# Altium schematic sheet obc-v2_RTC-WDOG.SchDoc
size 420 x 297 mm; SheetNumber: 7; SheetTotal: 23
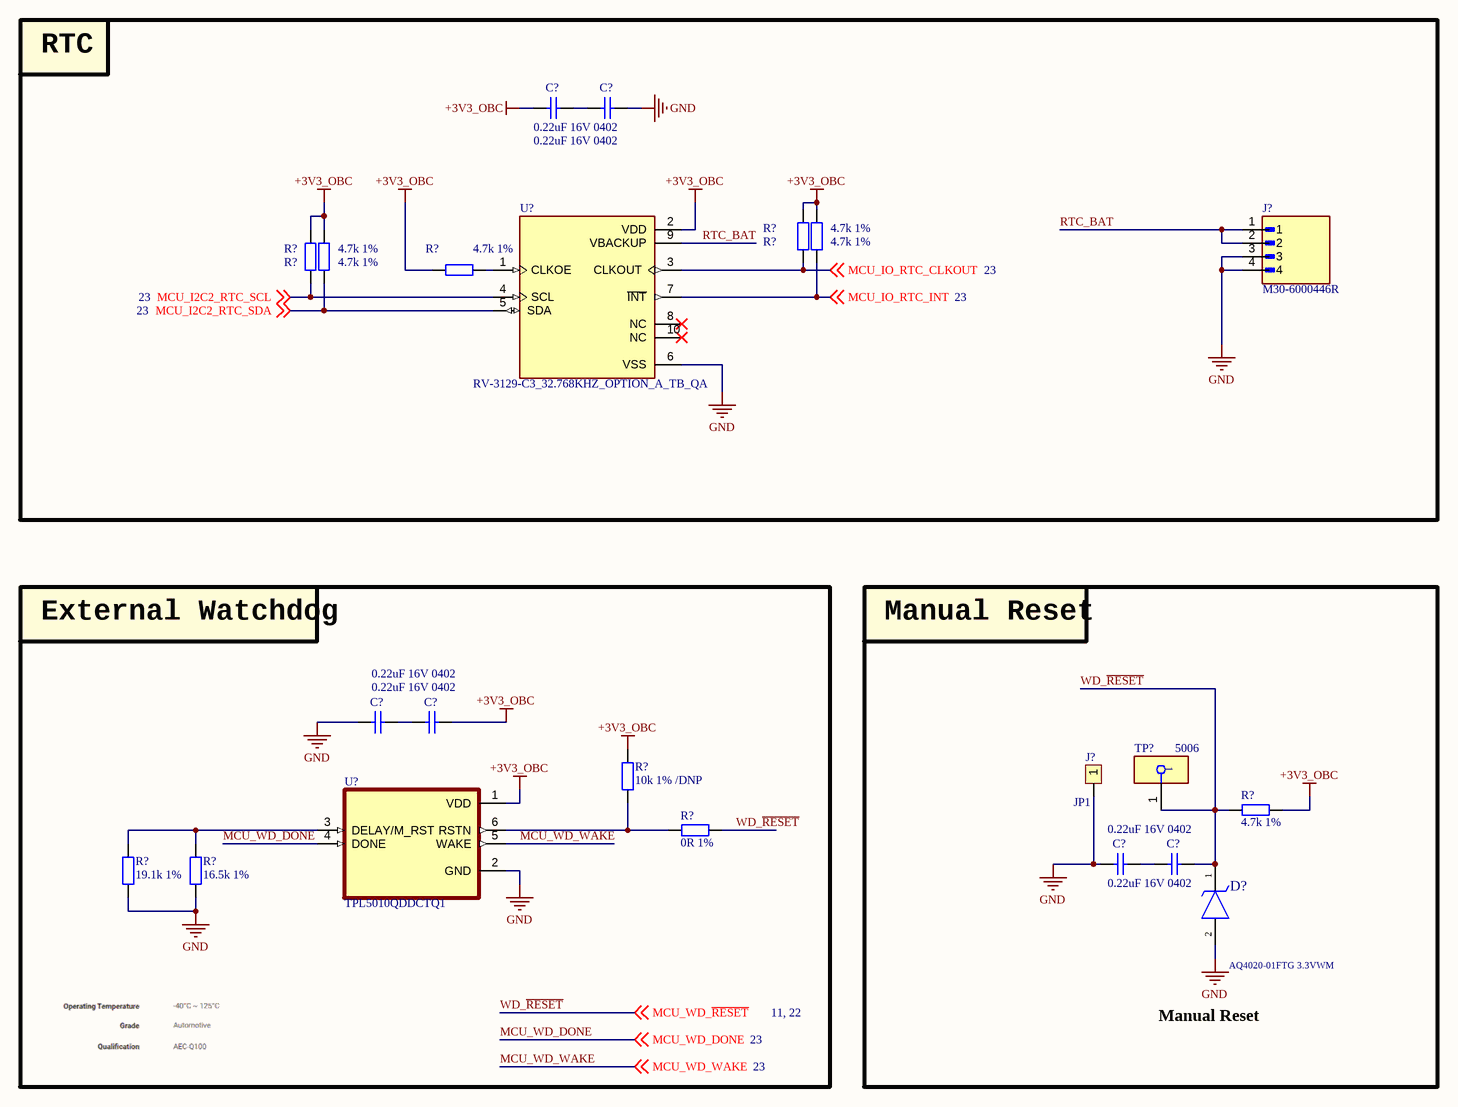
[diagram p0: obc-v2_RTC-WDOG.SchDoc]

## Parts
(Parts that share a designator on the sheet are numbered #1, #2 ... from top to bottom, then left to right.)
C?#1  0.22uF 16V 0402  [tu 0402]
C?#2  0.22uF 16V 0402  [tu 0402]
C?#3  0.22uF 16V 0402  [tu 0402]
C?#4  0.22uF 16V 0402  [tu 0402]
C?#5  0.22uF 16V 0402  [tu 0402]
C?#6  0.22uF 16V 0402  [tu 0402]
D?  3.3VWM: AQ4020-01FTG 3.3VWM  [SOD2613X114N]  (hidden comment: AQ4020-01FTG)
J?#1  M30-6000446R  [HARWIN_M30-6000446R]
J?#2  JP1  [JP1-D1T]
R?#1  4.7k 1%  [tro smd 0603]
R?#2  4.7k 1%  [tro smd 0603]
R?#3  4.7k 1%  [tro smd 0603]
R?#4  4.7k 1%  [tro smd 0603]
R?#5  4.7k 1%  [tro smd 0603]
R?#6  10k 1% /DNP  [tro smd 0603]
R?#7  4.7k 1%  [tro smd 0603]
R?#8  0R 1%  [tro smd 0603]
R?#9  19.1k 1%  [tro smd 0603]
R?#10  16.5k 1%  [tro smd 0603]
TP?  5006  [FP-5006-MFG]
U?#1  RV-3129-C3_32.768KHZ_OPTION_A_TB_QA  [IC_RV-3129-C3_32.768KHZ_OPTION_A_TB_QA]
U?#2  TPL5010QDDCTQ1  [SOT95P280X110-6N]

## Blocks framed on the sheet
RTC: C?#1 C?#2 J?#1 R?#1-R?#5 U?#1
External Watchdog: C?#3 C?#4 R?#6 R?#8-R?#10 U?#2
Manual Reset: C?#5 C?#6 D? J?#2 R?#7 TP?

## Nets
+3V3_OBC: C?#1.2 C?#4.1 R?#1.2 R?#2.2 R?#3.2 R?#4.2 R?#5.2 R?#6.2 R?#7.2 U?#1.2(VDD) U?#2.1(VDD)
GND: C?#2.1 C?#3.2 C?#5.2 D?.2 J?#1.3 J?#1.4 J?#2.1 R?#9.1 R?#10.1 U?#1.6(VSS) U?#2.2(GND)
MCU_I2C2_RTC_SCL: R?#3.1 U?#1.4(SCL) ; off-sheet MCU_I2C2_RTC_SCL
MCU_I2C2_RTC_SDA: R?#4.1 U?#1.5(SDA) ; off-sheet MCU_I2C2_RTC_SDA
MCU_IO_RTC_CLKOUT: R?#1.1 U?#1.3(CLKOUT) ; off-sheet MCU_IO_RTC_CLKOUT
MCU_IO_RTC_INT: R?#2.1 U?#1.7(~{INT}) ; off-sheet MCU_IO_RTC_INT
MCU_WD_DONE: U?#2.4(DONE) ; off-sheet MCU_WD_DONE
MCU_WD_WAKE: U?#2.5(WAKE) ; off-sheet MCU_WD_WAKE
RTC_BAT: J?#1.1 J?#1.2 U?#1.9(VBACKUP)
WD_~{RESET}: C?#6.1 D?.1 R?#7.1 R?#8.1 TP?.1 ; off-sheet MCU_WD_~{RESET}  [also labelled MCU_WD_~{RESET}]
NetC?#1_1: C?#1.1 C?#2.2
NetC?#3_1: C?#3.1 C?#4.2
NetC?#5_1: C?#5.1 C?#6.2
NetR?#5_1: R?#5.1 U?#1.1(CLKOE)
NetR?#6_1: R?#6.1 R?#8.2 U?#2.6(RSTN)
NetR?#9_2: R?#9.2 R?#10.2 U?#2.3(DELAY/M_RST)

Not connected (* = marked no-connect by the designer): U?#1 8(NC)* 10(NC)*

## Notes on the sheet
- Manual Reset
- Project:
- Sub-system:
- Design by:
- Sheet title:
- Sheet
- A3
- of
- Checked by:
- Approved by:
- Revision:
- Document No:
- Size:
- Date:

## Library data of the parts
C?#1-C?#6 = Tu 0402 33nF 10V: 0.22 µF ±10% 16V Ceramic Capacitor X7R 0402 (1005 Metric): GCM155R71C224KE02D; Chung_Loai: Dán; Don_Vi: Con; So_Chan: 2; Ten_Linh_Kien: Tụ 0402 33nF X7R 10V GRM155R71A333KA01D; Ma_Hang: MH007853; Kieu_Chan: *
D? = AQ4020-01FTG: ESD Suppressors / TVS Diodes 30A 2.5pF AEC-Q101; Manufacturer_Name: LITTELFUSE; Supplier: https://componentsearchengine.com/Datasheets/2/AQ4020-01FTG.pdf; Description_: ESD Suppressors / TVS Diodes 30A 2.5pF AEC-Q101; Height: 1.14; Mouser Part Number: 576-AQ4020-01FTG; Mouser Price/Stock: https://www.mouser.co.uk/ProductDetail/Littelfuse/AQ4020-01FTG?qs=YCa%2FAAYMW015W3B84qpvIw%3D%3D; Manufacturer_Part_Number: AQ4020-01FTG
J?#2 = JP1: WR-PHD 2.54 mm Angled Socket Header; Manufacturer: W¨¹rth Elektronik eiSos GmbH; partNo: 613002143121; ComponentLink1 Description: Manufacturer; ComponentLink2 Description: Datasheet; NoPins: 02; Created Date: 29 March 2013; ComponentLink1URL: http://www.we-online.com; ComponentLink2URL: http://katalog.we-online.de/em/datasheet/6130xx143121.pdf; Created by: Karrer Zheng
R?#1-R?#5 R?#7 = Tro 0603 1% 10k: RES 4.7K OHM 1% 1/10W 0603, P/N: ERJ-U03F4701V; Chung_Loai: Dán; Don_Vi: Con; So_Chan: 2; Ten_Linh_Kien: Trở 0603 1% 10k; Ma_Hang: MH006333; Kieu_Chan: *
R?#6 = Tro 0603 1% 10k: RES SMD 10K OHM 1% 1/10W 0603, P/N: ERJ-3EKF1002V; Chung_Loai: Dán; Don_Vi: Con; So_Chan: 2; Ten_Linh_Kien: Trở 0603 1% 10k; Ma_Hang: MH006333; Kieu_Chan: *
R?#8 = Tro 0603 1% 10k: RES SMD 0 OHM JUMPER 1/10W 0603, P/N: ERJ-3GEY0R00V; Chung_Loai: Dán; Don_Vi: Con; So_Chan: 2; Ten_Linh_Kien: Trở 0603 1% 10k; Ma_Hang: MH006333; Kieu_Chan: *
R?#9 = Tro 0603 1% 10k: RES SMD 19.1K OHM 1% 1/10W 0603, P/N: ERJ-3EKF1912V; Chung_Loai: Dán; Don_Vi: Con; So_Chan: 2; Ten_Linh_Kien: Trở 0603 1% 10k; Ma_Hang: MH006333; Kieu_Chan: *
R?#10 = Tro 0603 1% 10k: RES SMD 16.5K OHM 1% 1/10W 0603, P/N: ERJ-3EKF1652V; Chung_Loai: Dán; Don_Vi: Con; So_Chan: 2; Ten_Linh_Kien: Trở 0603 1% 10k; Ma_Hang: MH006333; Kieu_Chan: *
TP? = CMP-19636-000022-1: PC TEST POINT COMPACT BLACK; Body Material: Bronze; Inside Diameter: 1.78mm; Number of Ports: 1; Hole Diameter: 1.6mm; Outside Diameter: 3.18mm; Plating: Silver; Contact Plating: Tin; Color: Black; RoHS Compliant: Yes; Flammability Rating: UL94 V-0; Contact Material: Bronze; Material: Nylon; Orientation: Straight; Package Quantity: 100; Housing Color: Black; Length: 8.89mm; Series: THM; Mount: PCB; Height: 0.35inch; Packaging: Bulk; REACH SVHC: No SVHC; Insulation Material: Nylon; Lead Free: Lead Free
U?#1 = RV-3129-C3_32.768KHZ_OPTION_A_TB_QA: Real-Time Clock Module, Temperature compensated, in 2.5 x 3.7 mm package; MF: Micro Crystal; MP: RV-3129-C3 32.768KHZ OPTION A TB QA; SnapEDA_Link: https://www.snapeda.com/parts/RV-3129-C3%2032.768KHZ%20OPTION%20A%20TB%20QA/Micro+Crystal/view-part/?ref=snap; Package: QFN-10 Micro Crystal; Value: *; Check_prices: https://www.snapeda.com/parts/RV-3129-C3%2032.768KHZ%20OPTION%20A%20TB%20QA/Micro+Crystal/view-part/?ref=eda
J?#1 = M30-6000446R: Package: None; Price: None; Value: *; MP: M30-6000446R; Availability: Unavailable
U?#2 = TPL5010QDDCTQ1: Package: None; Price: None; Value: *; MP: TPL5010QDDCTQ1; Availability: Unavailable